# Altium schematic sheet Esquematico.SchDoc
size A4; SheetNumber: 1; SheetTotal: 1
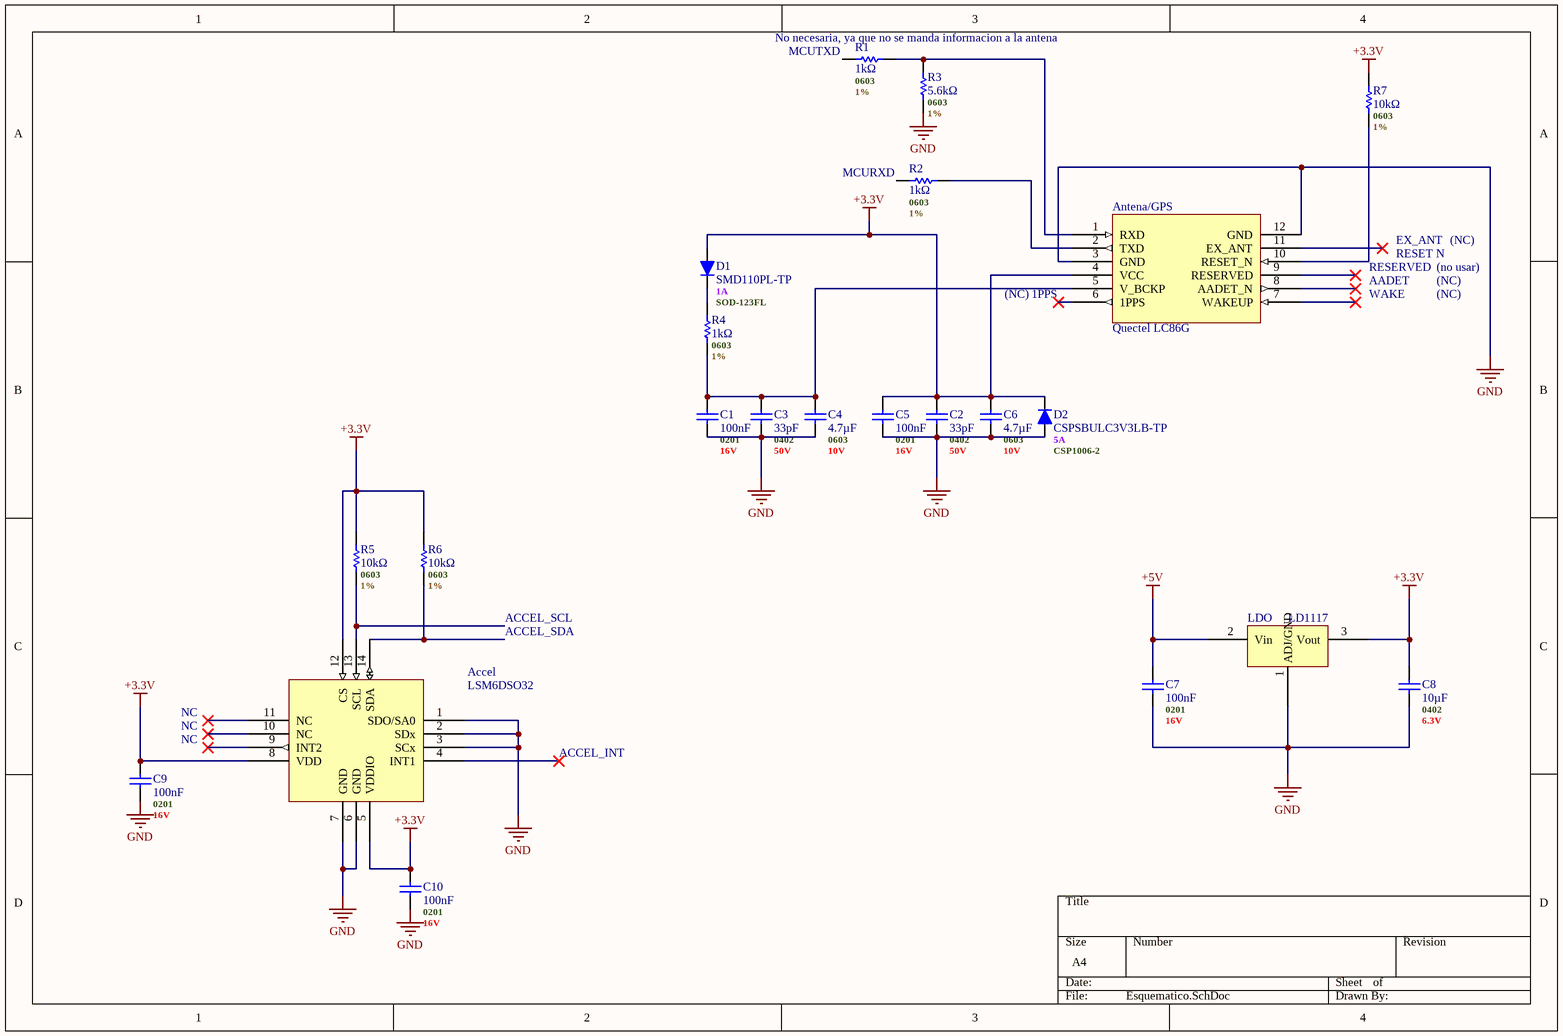
[diagram p0: Esquematico.SchDoc]

## Parts
Accel  LSM6DSO32  [14-LGA - STMicroelectronics V4]
Antena/GPS  Quectel LC86G  [Quectel-LC86L]
C1  100nF  .Case/Package: 0201  .Voltage Rating (DC): 16V  [CAPC0603X33N]
C2  33pF  .Case/Package: 0402  .Voltage Rating (DC): 50V  [CAP_CL05_SAM]
C3  33pF  .Case/Package: 0402  .Voltage Rating (DC): 50V  [CAP_CL05_SAM]
C4  4.7µF  .Case/Package: 0603  .Voltage Rating (DC): 10V  [0603-capacitor4.7uf]
C5  100nF  .Case/Package: 0201  .Voltage Rating (DC): 16V  [CAPC0603X33N]
C6  4.7µF  .Case/Package: 0603  .Voltage Rating (DC): 10V  [0603-capacitor4.7uf]
C7  100nF  .Case/Package: 0201  .Voltage Rating (DC): 16V  [CAPC0603X33N]
C8  10µF  .Case/Package: 0402  .Voltage Rating (DC): 6.3V  [CAP_CL05_SAM]
C9  100nF  .Case/Package: 0201  .Voltage Rating (DC): 16V  [CAPC0603X33N]
C10  100nF  .Case/Package: 0201  .Voltage Rating (DC): 16V  [CAPC0603X33N]
D1  SMD110PL-TP  .Current: 1A  .Case/Package: SOD-123FL  [SOD-123FL_MCC]
D2  CSPSBULC3V3LB-TP  .Current: 5A  .Case/Package: CSP1006-2  [CSPSBULC3V3LBTP]
LDO  LD1117  [DPAK-LD1117DT33TR V2]
R1  1kΩ  .Case/Package: 0603  .Tolerance: 1%  [RC0603N_YAG]
R2  1kΩ  .Case/Package: 0603  .Tolerance: 1%  [RC0603N_YAG]
R3  5.6kΩ  .Case/Package: 0603  .Tolerance: 1%  [RC0603N_YAG]
R4  1kΩ  .Case/Package: 0603  .Tolerance: 1%  [RC0603N_YAG]
R5  10kΩ  .Case/Package: 0603  .Tolerance: 1%  [RC0603N_YAG]
R6  10kΩ  .Case/Package: 0603  .Tolerance: 1%  [RC0603N_YAG]
R7  10kΩ  .Case/Package: 0603  .Tolerance: 1%  [RC0603N_YAG]

## Nets
+3.3V: Accel.5(VDDIO) Accel.8(VDD) Accel.12(CS) Antena/GPS.4(VCC) C2.1 C5.2 C6.2 C8.2 C9.2 C10.2 D1.A D2.K LDO.3(Vout) R5.2 R6.2 R7.2
+5V: C7.2 LDO.2(Vin)
GND: Accel.1(SDO/SA0) Accel.2(SDx) Accel.3(SCx) Accel.6(GND) Accel.7(GND) Antena/GPS.3(GND) Antena/GPS.12(GND) C1.1 C2.2 C3.2 C4.1 C5.1 C6.1 C7.1 C8.1 C9.1 C10.1 D2.A LDO.1(ADJ/GND) R3.1
NetAccel_13: Accel.13(SCL) R5.1
NetAccel_14: Accel.14(SDA) R6.1
NetAntena/GPS_1: Antena/GPS.1(RXD) R1.2 R3.2
NetAntena/GPS_2: Antena/GPS.2(TXD) R2.2
NetAntena/GPS_5: Antena/GPS.5(V_BCKP) C1.2 C3.1 C4.2 R4.1
NetAntena/GPS_10: Antena/GPS.10(RESET_N) R7.1
NetD1_K: D1.K R4.2

Not connected (* = marked no-connect by the designer): Accel 4(INT1)* 9(INT2)* 10(NC)* 11(NC)*; Antena/GPS 6(1PPS)* 7(WAKEUP)* 8(AADET_N)* 9(RESERVED)* 11(EX_ANT)*; R1 1; R2 1

## Notes on the sheet
- (near R1) No necesaria, ya que no se manda informacion a la antena
- (near R1) MCUTXD
- (near R2) MCURXD
- EX_ANT
- (NC)
- 1PPS
- RESERVED
- AADET
- WAKE
- RESET N
- (no usar)
- ACCEL_SCL
- ACCEL_SDA
- NC
- (near C9) NC
- ACCEL_INT

## Library data of the parts
Accel = LSM6DSO32: Accelerometer and 3D Gyroscope 3D Always-On 1.71V to 3.6V 0.55mA 14-Pin LGA T/R; Manufacturer: STMicroelectronics; Manufacturer Part Number: LSM6DSO32TR; Body Material: Plastic; Operating Supply Current: 550µA; Operating Supply Voltage: 1.8V; Output Configuration: Digital; Supplier: DigiKey; Supplier Part Number: 497-LSM6DSO32CT-ND; RoHS: Compliant; Category: Inertial Measurement Units (IMUs); Stock: 5000; Pricing: 1=3,64, 5=3,258, 10=3,115, 25=2,9448, 50=2,8282, 100=2,7213, 500=2,5064, 1000=2,45778 (USD); China RoHS: Compliant; Height: 860µm; Length: 3mm; Lifecycle Status: Production; Max Operating Temperature: 85°C; Max Supply Voltage: 3.6V; Min Operating Temperature: -40°C; Min Supply Voltage: 1.71V; Mounting Technology: Surface Mount; Number of Terminals: 14; Output Type: Digital; REACH SVHC: Yes; ComponentLink1URL: https://datasheet.octopart.com:443/LSM6DSO32TR-STMicroelectronics-datasheet-152560011.pdf?src-supplier=Upverter; ComponentLink1Description: https://datasheet.octopart.com:443/LSM6DSO32TR-STMicroelectronics-datasheet-152560011.pdf?src-supplier=Upverter; Supplier 1: DigiKey; Supplier Part Number 1: 497-LSM6DSO32CT-ND
Antena/GPS = Quectel LC86G: GNSS Module, BeiDou, Galileo, GLONASS, GPS, QZSS, 1.605375GHz, -166 dBm, 25 s, 2.55V to 3.6V; Manufacturer Part Number: LC86GLAMD; Number of Circuits: 1; Operating Supply Voltage: 3.3V; Supplier: DigiKey; Supplier Part Number: 2958-LC86GLAMDCT-ND; Manufacturer: Quectel; Category: RF Transceiver Modules and Modems; Stock: 191; Pricing: 1=10,82, 10=9,402, 25=8,908, 100=8,2298 (USD); Height - Seated (Max): 6.95mm; Length: 18.4mm; Max Operating Temperature: 85°C; Min Operating Temperature: -40°C; Number of Terminals: 36; Width: 18.4mm; ComponentLink1URL: https://datasheet.octopart.com:443/LC86GLAMD-Quectel-datasheet-165835560.pdf?src-supplier=SOS+electronic; ComponentLink1Description: https://datasheet.octopart.com:443/LC86GLAMD-Quectel-datasheet-165835560.pdf?src-supplier=SOS+electronic; Supplier 1: DigiKey; Supplier Part Number 1: 2958-LC86GLAMDCT-ND
C1 C5 C7 C9 C10 = CAP - GENERIC: 0201 0.1 uF 16 V ±10% Tolerance X7S Multilayer Ceramic Chip Capacitor; Manufacturer: Murata; Manufacturer Part Number: GRM033C71C104KE14D; Manufacturer Lifecycle Status: IN PRODUCTION; Supplier: DigiKey; Supplier Part Number: 490-10387-1-ND; RoHS: Compliant; Category: Ceramic Capacitors; Stock: 10213357; Pricing: 1=0,08, 10=0,006, 50=0,0048, 100=0,004 (USD); Value: 100nF; Case/Package: 0201; Case Code (Imperial): 0201; Case Code (Metric): 0603; Dielectric: X7S; Dielectric Material: Ceramic; Height: 300µm; Length: 600µm; Lifecycle Status: Production; Material: Ceramic; Max Operating Temperature: 125°C; Min Operating Temperature: -55°C; Mounting Technology: Surface Mount; Number of Terminals: 2; Packaging: Digi-Reel®; REACH SVHC: Yes; Schedule B: 8532240020, 8532240020|8532240020, 8532240020|8532240020|8532240020, 8532240020|8532240020|8532240020|8532240020; Termination: SMD/SMT; Thickness: 300µm; Tolerance: 10%; Voltage Rating: 16V; Voltage Rating (DC): 16V; Weight: 340.194278µg; Width: 300µm; ComponentLink1URL: https://datasheet.octopart.com:443/GRM033C71C104KE14D-Murata-datasheet-178521774.pdf?src-supplier=Arrow.cn; ComponentLink1Description: https://datasheet.octopart.com:443/GRM033C71C104KE14D-Murata-datasheet-178521774.pdf?src-supplier=Arrow.cn; ComponentLink2URL: https://datasheet.octopart.com:443/GRM033C71C104KE14D-Murata-datasheet-150009099.pdf?src-supplier=Arrow.cn; ComponentLink2Description: https://datasheet.octopart.com:443/GRM033C71C104KE14D-Murata-datasheet-150009099.pdf?src-supplier=Arrow.cn; ComponentLink3URL: https://datasheet.octopart.com:443/GRM033C71C104KE14D-Murata-datasheet-165579666.pdf?src-supplier=TME; ComponentLink3Description: https://datasheet.octopart.com:443/GRM033C71C104KE14D-Murata-datasheet-165579666.pdf?src-supplier=TME; ComponentLink4URL: https://datasheet.octopart.com:443/GRM033C71C104KE14D-Murata-datasheet-141274204.pdf?src-supplier=Ciiva; ComponentLink4Description: https://datasheet.octopart.com:443/GRM033C71C104KE14D-Murata-datasheet-141274204.pdf?src-supplier=Ciiva; ComponentLink5URL: https://datasheet.octopart.com:443/GRM033C71C104KE14D-Murata-datasheet-140675366.pdf?src-supplier=Ciiva; ComponentLink5Description: https://datasheet.octopart.com:443/GRM033C71C104KE14D-Murata-datasheet-140675366.pdf?src-supplier=Ciiva; ComponentLink6URL: https://datasheet.octopart.com:443/GRM033C71C104KE14D-Murata-datasheet-138738157.pdf?src-supplier=Ciiva; ComponentLink6Description: https://datasheet.octopart.com:443/GRM033C71C104KE14D-Murata-datasheet-138738157.pdf?src-supplier=Ciiva; ComponentLink7URL: https://datasheet.octopart.com:443/GRM033C71C104KE14D-Murata-datasheet-22122223.pdf?src-supplier=Future+Electronics; ComponentLink7Description: https://datasheet.octopart.com:443/GRM033C71C104KE14D-Murata-datasheet-22122223.pdf?src-supplier=Future+Electronics; ComponentLink8URL: https://datasheet.octopart.com/GRM033C71C104KE14D-Murata-datasheet-12515295.pdf; ComponentLink8Description: https://datasheet.octopart.com/GRM033C71C104KE14D-Murata-datasheet-12515295.pdf; ComponentLink9URL: https://datasheet.octopart.com/GRM033C71C104KE14D-Murata-datasheet-12510076.pdf; ComponentLink9Description: https://datasheet.octopart.com/GRM033C71C104KE14D-Murata-datasheet-12510076.pdf; ComponentLink10URL: https://datasheet.octopart.com/GRM033C71C104KE14D-Murata-datasheet-11978611.pdf; ComponentLink10Description: https://datasheet.octopart.com/GRM033C71C104KE14D-Murata-datasheet-11978611.pdf; ComponentLink11URL: https://datasheet.octopart.com/GRM033C71C104KE14D-Murata-datasheet-10025737.pdf; ComponentLink11Description: https://datasheet.octopart.com/GRM033C71C104KE14D-Murata-datasheet-10025737.pdf; ComponentLink12URL: https://datasheet.octopart.com/GRM033C71C104KE14D-Murata-datasheet-8819587.pdf; ComponentLink12Description: https://datasheet.octopart.com/GRM033C71C104KE14D-Murata-datasheet-8819587.pdf; ComponentLink13URL: http://sigma.octopart.com:80/reach_statement/Murata-company-16.pdf?src-supplier=Compliance+Statements; ComponentLink13Description: http://sigma.octopart.com:80/reach_statement/Murata-company-16.pdf?src-supplier=Compliance+Statements; Supplier 1: DigiKey; Supplier Part Number 1: 490-10387-1-ND
C2 C3 = CAP - GENERIC: Ceramic Capacitor, Multilayer, Ceramic, 50V, 5% +Tol, 5% -Tol, C0G, 0+-30ppm/Celcius TC, 33pF, Surface Mount, 0402 inch; Manufacturer: Samsung Electro-Mechanics; Manufacturer Part Number: CL05C330JB5NNNC; Temperature Coefficient: 30ppm/°C; Supplier: DigiKey; Supplier Part Number: 1276-1272-1-ND; RoHS: Compliant; Category: Ceramic Capacitors; Stock: 3272452; Pricing: 1=0,08, 10=0,003 (USD); Value: 33pF; Case/Package: 0402; Case Code (Imperial): 0402; Case Code (Metric): 1005; China RoHS: Compliant; Contact Plating: Tin; Depth: 500µm; Dielectric: C0G; Dielectric Material: Ceramic; Height: 550µm; Lead Free: Lead Free; Length: 1mm; Lifecycle Status: Production; Material: Ceramic; Max Operating Temperature: 125°C; Min Operating Temperature: -55°C; Mounting Technology: Surface Mount; Number of Terminals: 2; Radiation Hardening: No; REACH SVHC: Yes; Schedule B: 8532240020, 8532240020|8532240020, 8532240020|8532240020|8532240020, 8532240020|8532240020|8532240020|8532240020; Thickness: 558.8µm; Tolerance: 5%; Voltage: 50V; Voltage Rating: 50V; Voltage Rating (DC): 50V; Width: 500µm; ComponentLink1URL: https://datasheet.octopart.com:443/CL05C330JB5NNNC-Samsung-Electro-Mechanics-datasheet-136482269.pdf?src-supplier=IHS; ComponentLink1Description: https://datasheet.octopart.com:443/CL05C330JB5NNNC-Samsung-Electro-Mechanics-datasheet-136482269.pdf?src-supplier=IHS; ComponentLink2URL: https://datasheet.octopart.com:443/CL05C330JB5NNNC-Samsung-Electro-Mechanics-datasheet-141347004.pdf?src-supplier=Samsung+SCT; ComponentLink2Description: https://datasheet.octopart.com:443/CL05C330JB5NNNC-Samsung-Electro-Mechanics-datasheet-141347004.pdf?src-supplier=Samsung+SCT; ComponentLink3URL: https://datasheet.octopart.com:443/CL05C330JB5NNNC-Samsung-Electro-Mechanics-datasheet-110326805.pdf?src-supplier=Future+Electronics; ComponentLink3Description: https://datasheet.octopart.com:443/CL05C330JB5NNNC-Samsung-Electro-Mechanics-datasheet-110326805.pdf?src-supplier=Future+Electronics; ComponentLink4URL: https://datasheet.octopart.com:443/CL05C330JB5NNNC-Samsung-Electro-Mechanics-datasheet-81461748.pdf?src-supplier=Future+Electronics; ComponentLink4Description: https://datasheet.octopart.com:443/CL05C330JB5NNNC-Samsung-Electro-Mechanics-datasheet-81461748.pdf?src-supplier=Future+Electronics; ComponentLink5URL: https://datasheet.octopart.com:443/CL05C330JB5NNNC-Samsung-datasheet-12522687.pdf?src-supplier=Future+Electronics; ComponentLink5Description: https://datasheet.octopart.com:443/CL05C330JB5NNNC-Samsung-datasheet-12522687.pdf?src-supplier=Future+Electronics; ComponentLink6URL: https://datasheet.octopart.com:443/CL05C330JB5NNNC-Samsung-datasheet-26589087.pdf?src-supplier=Future+Electronics; ComponentLink6Description: https://datasheet.octopart.com:443/CL05C330JB5NNNC-Samsung-datasheet-26589087.pdf?src-supplier=Future+Electronics; ComponentLink7URL: https://datasheet.octopart.com:443/CL05C330JB5NNNC-Samsung-Electro-Mechanics-datasheet-149156440.pdf?src-supplier=Future+Electronics; ComponentLink7Description: https://datasheet.octopart.com:443/CL05C330JB5NNNC-Samsung-Electro-Mechanics-datasheet-149156440.pdf?src-supplier=Future+Electronics; ComponentLink8URL: https://datasheet.octopart.com:443/CL05C330JB5NNNC-Samsung-datasheet-37081328.pdf?src-supplier=Future+Electronics; ComponentLink8Description: https://datasheet.octopart.com:443/CL05C330JB5NNNC-Samsung-datasheet-37081328.pdf?src-supplier=Future+Electronics; ComponentLink9URL: https://datasheet.octopart.com/CL05C330JB5NNNC-Samsung-Electro-Mechanics-datasheet-97040617.pdf; ComponentLink9Description: https://datasheet.octopart.com/CL05C330JB5NNNC-Samsung-Electro-Mechanics-datasheet-97040617.pdf; ComponentLink10URL: https://datasheet.octopart.com/CL05C330JB5NNNC-Samsung-Electro-Mechanics-datasheet-8324245.pdf; ComponentLink10Description: https://datasheet.octopart.com/CL05C330JB5NNNC-Samsung-Electro-Mechanics-datasheet-8324245.pdf; ComponentLink11URL: https://datasheet.octopart.com:443/CL05C330JB5NNNC-Samsung-datasheet-8326407.pdf?src-supplier=TME; ComponentLink11Description: https://datasheet.octopart.com:443/CL05C330JB5NNNC-Samsung-datasheet-8326407.pdf?src-supplier=TME; Supplier 1: DigiKey; Supplier Part Number 1: 1276-1272-1-ND
C4 C6 = CAP - GENERIC: Ceramic Capacitor, Multilayer, Ceramic, 10V, 10% +Tol, 10% -Tol, X7R, 15% TC, 4.7uF, Surface Mount, 0603; Manufacturer: Cal-Chip Electronics; Manufacturer Part Number: GMC10X7R475K10NT; Supplier: DigiKey; Supplier Part Number: 4713-GMC10X7R475K10NTCT-ND; RoHS: Compliant; Category: Ceramic Capacitors; Stock: 237673; Pricing: 1=0,26, 10=0,154, 50=0,1112, 100=0,0982, 500=0,07628, 1000=0,06951, 4000=0,05938, 8000=0,05562, 12000=0,05374, 20000=0,05165, 28000=0,05043, 40000=0,04926, 48000=0,0487, 96000=0,04683, 100000=0,04673 (USD); Value: 4.7µF; China RoHS: Compliant; Dielectric Material: Ceramic; Height: 900µm; Length: 1.6mm; Lifecycle Status: Production; Max Operating Temperature: 125°C; Min Operating Temperature: -55°C; Mounting Technology: Surface Mount; Number of Terminals: 2; REACH SVHC: Yes; Voltage Rating (DC): 10V; Width: 800µm; ComponentLink1URL: https://datasheet.octopart.com:443/GMC10X7R475K10NT-Cal-Chip-Electronics-datasheet-182028815.pdf?src-supplier=IHS; ComponentLink1Description: https://datasheet.octopart.com:443/GMC10X7R475K10NT-Cal-Chip-Electronics-datasheet-182028815.pdf?src-supplier=IHS; Supplier 1: DigiKey; Supplier Part Number 1: 4713-GMC10X7R475K10NTCT-ND
C8 = CAP - GENERIC: 6.3V 10uF X5R ±20% 0402 Multilayer Ceramic Capacitors MLCC - SMD/SMT ROHS; Manufacturer: Samsung Electro-Mechanics; Manufacturer Part Number: CL05A106MQ5NUNC; Supplier: DigiKey; Supplier Part Number: 1276-1451-1-ND; RoHS: Compliant; Category: Ceramic Capacitors; Stock: 3652212; Pricing: 1=0,1, 10=0,054, 50=0,0464, 2500=0,044, 5000=0,0407 (USD); Value: 10µF; Case/Package: 0402; Case Code (Imperial): 0402; Case Code (Metric): 1005; China RoHS: Compliant; Depth: 500µm; Dielectric: X5R; Dielectric Material: Ceramic; Height: 700µm; Length: 1mm; Lifecycle Status: Production; Max Operating Temperature: 85°C; Min Operating Temperature: -55°C; Mounting Technology: Surface Mount; Number of Terminals: 2; Radiation Hardening: No; REACH SVHC: Yes; Schedule B: 8532240020, 8532240020|8532240020, 8532240020|8532240020|8532240020, 8532240020|8532240020|8532240020|8532240020; Thickness: 711.2µm; Tolerance: 20%; Voltage Rating: 6.3V; Voltage Rating (DC): 6.3V; Width: 500µm; ComponentLink1URL: https://datasheet.octopart.com:443/CL05A106MQ5NUNC-Samsung-Electro-Mechanics-datasheet-136031724.pdf?src-supplier=Newark; ComponentLink1Description: https://datasheet.octopart.com:443/CL05A106MQ5NUNC-Samsung-Electro-Mechanics-datasheet-136031724.pdf?src-supplier=Newark; ComponentLink2URL: https://datasheet.octopart.com:443/CL05A106MQ5NUNC-Samsung-Electro-Mechanics-datasheet-181551184.pdf?src-supplier=Newark; ComponentLink2Description: https://datasheet.octopart.com:443/CL05A106MQ5NUNC-Samsung-Electro-Mechanics-datasheet-181551184.pdf?src-supplier=Newark; ComponentLink3URL: https://datasheet.octopart.com:443/CL05A106MQ5NUNC-Samsung-Electro-Mechanics-datasheet-110226207.pdf?src-supplier=Future+Electronics; ComponentLink3Description: https://datasheet.octopart.com:443/CL05A106MQ5NUNC-Samsung-Electro-Mechanics-datasheet-110226207.pdf?src-supplier=Future+Electronics; ComponentLink4URL: https://datasheet.octopart.com:443/CL05A106MQ5NUNC-Samsung-Electro-Mechanics-datasheet-81461596.pdf?src-supplier=Future+Electronics; ComponentLink4Description: https://datasheet.octopart.com:443/CL05A106MQ5NUNC-Samsung-Electro-Mechanics-datasheet-81461596.pdf?src-supplier=Future+Electronics; ComponentLink5URL: https://datasheet.octopart.com:443/CL05A106MQ5NUNC-Samsung-datasheet-42280528.pdf?src-supplier=Future+Electronics; ComponentLink5Description: https://datasheet.octopart.com:443/CL05A106MQ5NUNC-Samsung-datasheet-42280528.pdf?src-supplier=Future+Electronics; ComponentLink6URL: https://datasheet.octopart.com:443/CL05A106MQ5NUNC-Samsung-datasheet-34153003.pdf?src-supplier=Future+Electronics; ComponentLink6Description: https://datasheet.octopart.com:443/CL05A106MQ5NUNC-Samsung-datasheet-34153003.pdf?src-supplier=Future+Electronics; ComponentLink7URL: https://datasheet.octopart.com:443/CL05A106MQ5NUNC-Samsung-datasheet-26589001.pdf?src-supplier=Future+Electronics; ComponentLink7Description: https://datasheet.octopart.com:443/CL05A106MQ5NUNC-Samsung-datasheet-26589001.pdf?src-supplier=Future+Electronics; ComponentLink8URL: https://datasheet.octopart.com:443/CL05A106MQ5NUNC-Samsung-datasheet-12538126.pdf?src-supplier=Future+Electronics; ComponentLink8Description: https://datasheet.octopart.com:443/CL05A106MQ5NUNC-Samsung-datasheet-12538126.pdf?src-supplier=Future+Electronics; ComponentLink9URL: https://datasheet.octopart.com:443/CL05A106MQ5NUNC-Samsung-Electro-Mechanics-datasheet-149136671.pdf?src-supplier=Future+Electronics; ComponentLink9Description: https://datasheet.octopart.com:443/CL05A106MQ5NUNC-Samsung-Electro-Mechanics-datasheet-149136671.pdf?src-supplier=Future+Electronics; ComponentLink10URL: https://datasheet.octopart.com:443/CL05A106MQ5NUNC-Samsung-datasheet-59220082.pdf?src-supplier=TME; ComponentLink10Description: https://datasheet.octopart.com:443/CL05A106MQ5NUNC-Samsung-datasheet-59220082.pdf?src-supplier=TME; Supplier 1: DigiKey; Supplier Part Number 1: 1276-1451-1-ND
D1 = DIODE: Rectifier Diode, Schottky, 1 Phase, 1 Element, 1A, 100V V(RRM), Silicon; Manufacturer: MCC; Element Configuration: Single; Forward Voltage: 850mV; Max Forward Surge Current (Ifsm): 30A; Number of Elements: 1; Peak Reverse Current: 10µA; Supplier: DigiKey; Supplier Part Number: SMD110PL-TPMSDKR-ND; Manufacturer Part Number: SMD110PL-TP; RoHS: Compliant; Category: Rectifier Diodes; Stock: 3407126; Pricing: 1=0,19, 10=0,118, 100=0,0796, 500=0,05812, 1000=0,05115 (USD); Average Rectified Current: 1A; China RoHS: Non-Compliant; Forward Current: 1A; Lead Free: Lead Free; Lifecycle Status: Production; Max Operating Temperature: 150°C; Max Output current: 1A; Max Repetitive Reverse Voltage (Vrrm): 100V; Max Reverse Voltage (DC): 100V; Min Operating Temperature: -55°C; Mounting Technology: Surface Mount; Pins: 2; Number of Terminals: 2; Packaging: Tape and Reel; Peak Non-Repetitive Surge Current: 30A; Radiation Hardening: No; REACH SVHC: No; Reverse Standoff Voltage: 100V; Schedule B: 8541100080, 8541100080|8541100080|8541100080|8541100080|8541100080; ComponentLink1URL: https://datasheet.octopart.com:443/SMD110PL-TP-MCC-datasheet-103922842.pdf?src-supplier=Future+Electronics; ComponentLink1Description: https://datasheet.octopart.com:443/SMD110PL-TP-MCC-datasheet-103922842.pdf?src-supplier=Future+Electronics; ComponentLink2URL: https://datasheet.octopart.com:443/SMD110PL-TP-MCC-datasheet-27907079.pdf?src-supplier=Future+Electronics; ComponentLink2Description: https://datasheet.octopart.com:443/SMD110PL-TP-MCC-datasheet-27907079.pdf?src-supplier=Future+Electronics
D2 = DIODE: Trans Voltage Suppressor Diode, 13W, 3.3V V(RWM), Bidirectional, 1 Element, Silicon; Manufacturer: MCC; Breakdown Voltage: 6.5V; Clamping Voltage: 2.9V; Max Breakdown Voltage: 8V; Min Breakdown Voltage: 4.5V; Number of Elements: 1; Peak Reverse Current: 100nA; Supplier: DigiKey; Supplier Part Number: 353-CSPSBULC3V3LB-TPCT-ND; Manufacturer Part Number: CSPSBULC3V3LB-TP; RoHS: Compliant; Category: TVS Diodes; Stock: 8320; Pricing: 1=0,23, 10=0,152, 100=0,076, 500=0,06174, 1000=0,044, 2000=0,041, 5000=0,036 (USD); Lifecycle Status: Production; Max Operating Temperature: 125°C; Min Operating Temperature: -55°C; Number of Terminals: 2; Peak Pulse Power: 13W; Polarity: Bidirectional; REACH SVHC: Yes; Reverse Standoff Voltage: 3.3V
LDO = LD1117: Output ail-to- ail Very-Low-Noise Operational Amplifier 14-SOIC -40 to 125; Manufacturer: STMicroelectronics; Manufacturer Part Number: LD1117DT33TR; Accuracy: 1%; Dropout Voltage: 1.1V; Input Bias Current: 5mA; Max Supply Voltage: 15V; Max Junction Temperature (Tj): 125°C; Max Output current: 1.3A; Max Power Dissipation: 12W; Min Input Voltage: 4.75V; Nominal Output Voltage: 3.3V; Number of Channels: 1; Output Current: 800mA; Output Type: Fixed; Polarity: Positive; Voltage Tolerance: 2%; Supplier: DigiKey; Supplier Part Number: 497-1236-1-ND; RoHS: Compliant; Category: LDO Voltage Regulators; Stock: 24539; Pricing: 1=0,48, 10=0,339, 25=0,3028, 100=0,2629, 250=0,24392, 500=0,23244, 1000=0,22299 (USD); Case/Package: TO-252; China RoHS: Non-Compliant; Contact Plating: Tin; Height: 2.4mm; Height - Seated (Max): 2.3mm; Length: 6.5mm; Lifecycle Status: Production; Max Operating Temperature: 125°C; Min Operating Temperature: 0°C; Mounting Technology: Surface Mount; Nominal Supply Current: 5mA; Number of Circuits: 1; Number of Outputs: 1; Pins: 3; Number of Regulators: 1; Number of Terminals: 2; Output Voltage: 3.3V; Output Voltage Accuracy: 1%; Packaging: Tape and Reel; Power Dissipation: 12W; Power Rating: 12W; Quiescent Current: 5mA; Radiation Hardening: No; REACH SVHC: No; Schedule B: 8542390000, 8542390000|8542390000|8542390000|8542390000|8542390000; Terminal Pitch: 2.28mm; Tolerance: 1%; Weight: 4.535924g; Width: 6.1mm; ComponentLink1URL: https://datasheet.octopart.com:443/LD1117DT33TR-STMicroelectronics-datasheet-21631343.pdf?src-supplier=element14+APAC; ComponentLink1Description: https://datasheet.octopart.com:443/LD1117DT33TR-STMicroelectronics-datasheet-21631343.pdf?src-supplier=element14+APAC; ComponentLink2URL: https://datasheet.octopart.com:443/LD1117DT33TR-STMicroelectronics-datasheet-12512609.pdf?src-supplier=Upverter; ComponentLink2Description: https://datasheet.octopart.com:443/LD1117DT33TR-STMicroelectronics-datasheet-12512609.pdf?src-supplier=Upverter; ComponentLink3URL: https://datasheet.octopart.com:443/LD1117DT33TR-STMicroelectronics-datasheet-10835789.pdf?src-supplier=Upverter; ComponentLink3Description: https://datasheet.octopart.com:443/LD1117DT33TR-STMicroelectronics-datasheet-10835789.pdf?src-supplier=Upverter; ComponentLink4URL: https://datasheet.octopart.com:443/LD1117DT33TR-STMicroelectronics-datasheet-10544930.pdf?src-supplier=Upverter; ComponentLink4Description: https://datasheet.octopart.com:443/LD1117DT33TR-STMicroelectronics-datasheet-10544930.pdf?src-supplier=Upverter; ComponentLink5URL: https://datasheet.octopart.com:443/LD1117DT33TR-STMicroelectronics-datasheet-10390305.pdf?src-supplier=Upverter; ComponentLink5Description: https://datasheet.octopart.com:443/LD1117DT33TR-STMicroelectronics-datasheet-10390305.pdf?src-supplier=Upverter; ComponentLink6URL: https://datasheet.octopart.com:443/LD1117DT33TR-STMicroelectronics-datasheet-8082140.pdf?src-supplier=element14; ComponentLink6Description: https://datasheet.octopart.com:443/LD1117DT33TR-STMicroelectronics-datasheet-8082140.pdf?src-supplier=element14; ComponentLink7URL: https://datasheet.octopart.com:443/LD1117DT33TR-STMicroelectronics-datasheet-8710537.pdf?src-supplier=element14; ComponentLink7Description: https://datasheet.octopart.com:443/LD1117DT33TR-STMicroelectronics-datasheet-8710537.pdf?src-supplier=element14; ComponentLink8URL: https://datasheet.octopart.com:443/LD1117DT33TR-STMicroelectronics-datasheet-8453752.pdf?src-supplier=element14; ComponentLink8Description: https://datasheet.octopart.com:443/LD1117DT33TR-STMicroelectronics-datasheet-8453752.pdf?src-supplier=element14; ComponentLink9URL: https://datasheet.octopart.com:443/LD1117DT33TR-STMicroelectronics-datasheet-9746.pdf?src-supplier=DigiKey; ComponentLink9Description: https://datasheet.octopart.com:443/LD1117DT33TR-STMicroelectronics-datasheet-9746.pdf?src-supplier=DigiKey; ComponentLink10URL: https://datasheet.octopart.com:443/LD1117DT33TR-STMicroelectronics-datasheet-14168930.pdf?src-supplier=iiiC; ComponentLink10Description: https://datasheet.octopart.com:443/LD1117DT33TR-STMicroelectronics-datasheet-14168930.pdf?src-supplier=iiiC; ComponentLink11URL: https://datasheet.octopart.com:443/LD1117DT33TR-STMicroelectronics-datasheet-5314031.pdf?src-supplier=Nu+Horizons; ComponentLink11Description: https://datasheet.octopart.com:443/LD1117DT33TR-STMicroelectronics-datasheet-5314031.pdf?src-supplier=Nu+Horizons; ComponentLink12URL: https://datasheet.octopart.com:443/LD1117DT33TR-STMicroelectronics-datasheet-502396.pdf?src-supplier=Nu+Horizons; ComponentLink12Description: https://datasheet.octopart.com:443/LD1117DT33TR-STMicroelectronics-datasheet-502396.pdf?src-supplier=Nu+Horizons; ComponentLink13URL: https://datasheet.octopart.com:443/LD1117DT33TR-STMicroelectronics-datasheet-109521.pdf?src-supplier=Nu+Horizons; ComponentLink13Description: https://datasheet.octopart.com:443/LD1117DT33TR-STMicroelectronics-datasheet-109521.pdf?src-supplier=Nu+Horizons; ComponentLink14URL: https://datasheet.octopart.com:443/LD1117DT33TR-STMicroelectronics-datasheet-7556021.pdf?src-supplier=Jameco; ComponentLink14Description: https://datasheet.octopart.com:443/LD1117DT33TR-STMicroelectronics-datasheet-7556021.pdf?src-supplier=Jameco; ComponentLink15URL: https://datasheet.octopart.com:443/LD1117DT33TR-STMicroelectronics-datasheet-113917.pdf?src-supplier=Sierra+IC; ComponentLink15Description: https://datasheet.octopart.com:443/LD1117DT33TR-STMicroelectronics-datasheet-113917.pdf?src-supplier=Sierra+IC; Supplier 1: DigiKey; Supplier Part Number 1: 497-1236-1-ND
R1 R2 R4 = RESISTOR - GENERIC: Fixed Resistor, Thin Film, 0.1W, 1000ohm, 75V, 1% +/-Tol, 50ppm/Cel, Surface Mount, 0603; Manufacturer: Yageo Group; Manufacturer Part Number: RT0603FRE071KL; Max Power Dissipation: 100mW; Temperature Coefficient: 50ppm/°C; Supplier: DigiKey; Supplier Part Number: YAG2323CT-ND; RoHS: Compliant; Category: Chip SMD Resistors; Stock: 146447; Pricing: 1=0,1, 10=0,014, 25=0,0112, 50=0,0082, 100=0,0081, 250=0,00764 (USD); Case/Package: 0603; Case Code (Imperial): 0603; China RoHS: Non-Compliant; Composition: Thin Film; Contact Plating: Lead, Tin; Depth: 800µm; Features: Moisture Resistant; Height: 450µm; Lead Free: Lead Free; Length: 1.6mm; Lifecycle Status: Production; Max Operating Temperature: 155°C; Military Standard: Not; Min Operating Temperature: -55°C; Mounting Technology: Surface Mount; Pins: 2; Number of Terminals: 2; Number of Terminations: 2; Packaging: Tape & Reel; Power Dissipation: 100mW; Power Rating: 100mW; REACH SVHC: Yes; Value: 1kΩ; Schedule B: 8533210045, 8533210045|8533210045|8533210045|8533210045|8533210045|8533210045|8533210045|8533210045|8533210045|8533210045|8533210045|8533210045|8533210045|8533210045|8533210045|8533210045|8533210045|8533210045|8533210045|8533210045|8533210045|8533210045|8533210045|85; Termination: SMD/SMT; Tolerance: 1%; Voltage Rating: 75V; Voltage Rating (DC): 75V; Width: 800µm; Working Voltage: 75V; ComponentLink1URL: https://datasheet.octopart.com:443/RT0603FRE071KL-Yageo-datasheet-176402239.pdf?src-supplier=IHS; ComponentLink1Description: https://datasheet.octopart.com:443/RT0603FRE071KL-Yageo-datasheet-176402239.pdf?src-supplier=IHS; ComponentLink2URL: https://datasheet.octopart.com:443/RT0603FRE071KL-Yageo-datasheet-10915759.pdf?src-supplier=element14+APAC; ComponentLink2Description: https://datasheet.octopart.com:443/RT0603FRE071KL-Yageo-datasheet-10915759.pdf?src-supplier=element14+APAC; ComponentLink3URL: https://datasheet.octopart.com:443/RT0603FRE071KL-Yageo-datasheet-67645616.pdf?src-supplier=element14+APAC; ComponentLink3Description: https://datasheet.octopart.com:443/RT0603FRE071KL-Yageo-datasheet-67645616.pdf?src-supplier=element14+APAC; ComponentLink4URL: https://datasheet.octopart.com:443/RT0603FRE071KL-Yageo-datasheet-8324589.pdf?src-supplier=Newark; ComponentLink4Description: https://datasheet.octopart.com:443/RT0603FRE071KL-Yageo-datasheet-8324589.pdf?src-supplier=Newark; ComponentLink5URL: https://datasheet.octopart.com:443/RT0603FRE071KL-Yageo-datasheet-164439670.pdf?src-supplier=Newark; ComponentLink5Description: https://datasheet.octopart.com:443/RT0603FRE071KL-Yageo-datasheet-164439670.pdf?src-supplier=Newark; ComponentLink6URL: https://datasheet.octopart.com:443/RT0603FRE071KL-Yageo-datasheet-169971040.pdf?src-supplier=Future+Electronics; ComponentLink6Description: https://datasheet.octopart.com:443/RT0603FRE071KL-Yageo-datasheet-169971040.pdf?src-supplier=Future+Electronics; ComponentLink7URL: https://datasheet.octopart.com:443/RT0603FRE071KL-Yageo-datasheet-166250672.pdf?src-supplier=Future+Electronics; ComponentLink7Description: https://datasheet.octopart.com:443/RT0603FRE071KL-Yageo-datasheet-166250672.pdf?src-supplier=Future+Electronics; ComponentLink8URL: https://datasheet.octopart.com:443/RT0603FRE071KL-Yageo-datasheet-136673517.pdf?src-supplier=Future+Electronics; ComponentLink8Description: https://datasheet.octopart.com:443/RT0603FRE071KL-Yageo-datasheet-136673517.pdf?src-supplier=Future+Electronics; ComponentLink9URL: https://datasheet.octopart.com:443/RT0603FRE071KL-Yageo-datasheet-137700930.pdf?src-supplier=Future+Electronics; ComponentLink9Description: https://datasheet.octopart.com:443/RT0603FRE071KL-Yageo-datasheet-137700930.pdf?src-supplier=Future+Electronics; ComponentLink10URL: https://datasheet.octopart.com:443/RT0603FRE071KL-Yageo-datasheet-96443642.pdf?src-supplier=Future+Electronics; ComponentLink10Description: https://datasheet.octopart.com:443/RT0603FRE071KL-Yageo-datasheet-96443642.pdf?src-supplier=Future+Electronics; ComponentLink11URL: https://datasheet.octopart.com:443/RT0603FRE071KL-Yageo-datasheet-68361100.pdf?src-supplier=Future+Electronics; ComponentLink11Description: https://datasheet.octopart.com:443/RT0603FRE071KL-Yageo-datasheet-68361100.pdf?src-supplier=Future+Electronics; ComponentLink12URL: https://datasheet.octopart.com:443/RT0603FRE071KL-Yageo-datasheet-41589729.pdf?src-supplier=Future+Electronics; ComponentLink12Description: https://datasheet.octopart.com:443/RT0603FRE071KL-Yageo-datasheet-41589729.pdf?src-supplier=Future+Electronics; ComponentLink13URL: https://datasheet.octopart.com:443/RT0603FRE071KL-Yageo-datasheet-12594463.pdf?src-supplier=Future+Electronics; ComponentLink13Description: https://datasheet.octopart.com:443/RT0603FRE071KL-Yageo-datasheet-12594463.pdf?src-supplier=Future+Electronics; ComponentLink14URL: https://datasheet.octopart.com:443/RT0603FRE071KL-Yageo-datasheet-34924148.pdf?src-supplier=Future+Electronics; ComponentLink14Description: https://datasheet.octopart.com:443/RT0603FRE071KL-Yageo-datasheet-34924148.pdf?src-supplier=Future+Electronics; ComponentLink15URL: https://datasheet.octopart.com:443/RT0603FRE071KL-Yageo-Group-datasheet-141265893.pdf?src-supplier=ODG+(Origin+Data+Global); ComponentLink15Description: https://datasheet.octopart.com:443/RT0603FRE071KL-Yageo-Group-datasheet-141265893.pdf?src-supplier=ODG+(Origin+Data+Global); ComponentLink16URL: https://datasheet.octopart.com:443/RT0603FRE071KL-Yageo-datasheet-83209228.pdf?src-supplier=SOS+electronic; ComponentLink16Description: https://datasheet.octopart.com:443/RT0603FRE071KL-Yageo-datasheet-83209228.pdf?src-supplier=SOS+electronic; ComponentLink17URL: https://datasheet.octopart.com/RT0603FRE071KL-Yageo-datasheet-86813807.pdf; ComponentLink17Description: https://datasheet.octopart.com/RT0603FRE071KL-Yageo-datasheet-86813807.pdf; ComponentLink18URL: http://sigma.octopart.com:80/rohs_statement/Yageo-company-2.pdf?src-supplier=Compliance+Statements; ComponentLink18Description: http://sigma.octopart.com:80/rohs_statement/Yageo-company-2.pdf?src-supplier=Compliance+Statements; ComponentLink19URL: http://sigma.octopart.com:80/conflict_mineral_statement/Yageo-company-3.pdf?src-supplier=Compliance+Statements; ComponentLink19Description: http://sigma.octopart.com:80/conflict_mineral_statement/Yageo-company-3.pdf?src-supplier=Compliance+Statements; Supplier 1: DigiKey; Supplier Part Number 1: YAG2323CT-ND
R3 = RESISTOR - GENERIC: Res Thick Film 0603 5.6K Ohm 1% 0.1W(1/10W) ±100ppm/C Pad SMD T/R; Manufacturer: Yageo Group; Manufacturer Part Number: RC0603FR-075K6L; Max Power Dissipation: 100mW; Temperature Coefficient: 100ppm/°C; Voltage Rating: 50V; Working Voltage: 75V; Supplier: DigiKey; Supplier Part Number: 311-5.60KHRCT-ND; RoHS: Compliant; Category: Chip SMD Resistors; Stock: 87676; Pricing: 1=0,1, 10=0,009, 25=0,0088, 50=0,0082, 100=0,0051 (USD); Case/Package: 0603; Case Code (Imperial): 0603; Case Code (Metric): 1608; China RoHS: Non-Compliant; Composition: Thick Film; Depth: 800µm; Features: Moisture Resistant; Height: 450µm; Lead Free: Lead Free; Length: 1.6mm; Lifecycle Status: Production; Max Operating Temperature: 155°C; Military Standard: Not; Min Operating Temperature: -55°C; Mounting Technology: Surface Mount; Pins: 2; Number of Terminals: 2; Number of Terminations: 2; Packaging: Tape and Reel; Power Dissipation: 100mW; Power Rating: 100mW; REACH SVHC: Yes; Value: 5.6kΩ; Schedule B: 8533210045, 8533210045|8533210045, 8533210045|8533210045|8533210045, 8533210045|8533210045|8533210045|8533210045; Termination: SMD/SMT; Tolerance: 1%; Voltage Rating (AC): 50V; Voltage Rating (DC): 50V; Weight: 2.012816mg; Width: 800µm; ComponentLink1URL: https://datasheet.octopart.com:443/RC0603FR-075K6L-Yageo-datasheet-175887523.pdf?src-supplier=IHS; ComponentLink1Description: https://datasheet.octopart.com:443/RC0603FR-075K6L-Yageo-datasheet-175887523.pdf?src-supplier=IHS; ComponentLink2URL: https://datasheet.octopart.com:443/RC0603FR-075K6L-Yageo-datasheet-62067350.pdf?src-supplier=Newark; ComponentLink2Description: https://datasheet.octopart.com:443/RC0603FR-075K6L-Yageo-datasheet-62067350.pdf?src-supplier=Newark; ComponentLink3URL: https://datasheet.octopart.com:443/RC0603FR-075K6L-Yageo-datasheet-8328172.pdf?src-supplier=Newark; ComponentLink3Description: https://datasheet.octopart.com:443/RC0603FR-075K6L-Yageo-datasheet-8328172.pdf?src-supplier=Newark; ComponentLink4URL: https://datasheet.octopart.com:443/RC0603FR-075K6L-Yageo-datasheet-34211833.pdf?src-supplier=Newark; ComponentLink4Description: https://datasheet.octopart.com:443/RC0603FR-075K6L-Yageo-datasheet-34211833.pdf?src-supplier=Newark; ComponentLink5URL: https://datasheet.octopart.com:443/RC0603FR-075K6L-Yageo-datasheet-503470.pdf?src-supplier=Newark; ComponentLink5Description: https://datasheet.octopart.com:443/RC0603FR-075K6L-Yageo-datasheet-503470.pdf?src-supplier=Newark; ComponentLink6URL: https://datasheet.octopart.com:443/RC0603FR-075K6L-Yageo-Group-datasheet-176638170.pdf?src-supplier=Newark; ComponentLink6Description: https://datasheet.octopart.com:443/RC0603FR-075K6L-Yageo-Group-datasheet-176638170.pdf?src-supplier=Newark; ComponentLink7URL: https://datasheet.octopart.com:443/RC0603FR-075K6L-Yageo-datasheet-103092701.pdf?src-supplier=Upverter; ComponentLink7Description: https://datasheet.octopart.com:443/RC0603FR-075K6L-Yageo-datasheet-103092701.pdf?src-supplier=Upverter; ComponentLink8URL: https://datasheet.octopart.com:443/RC0603FR-075K6L-Yageo-datasheet-98239111.pdf?src-supplier=Upverter; ComponentLink8Description: https://datasheet.octopart.com:443/RC0603FR-075K6L-Yageo-datasheet-98239111.pdf?src-supplier=Upverter; ComponentLink9URL: https://datasheet.octopart.com:443/RC0603FR-075K6L-Yageo-datasheet-164759695.pdf?src-supplier=Future+Electronics; ComponentLink9Description: https://datasheet.octopart.com:443/RC0603FR-075K6L-Yageo-datasheet-164759695.pdf?src-supplier=Future+Electronics; ComponentLink10URL: https://datasheet.octopart.com:443/RC0603FR-075K6L-Yageo-datasheet-137700087.pdf?src-supplier=Future+Electronics; ComponentLink10Description: https://datasheet.octopart.com:443/RC0603FR-075K6L-Yageo-datasheet-137700087.pdf?src-supplier=Future+Electronics; ComponentLink11URL: https://datasheet.octopart.com:443/RC0603FR075K6L-Yageo-datasheet-27584510.pdf?src-supplier=Future+Electronics; ComponentLink11Description: https://datasheet.octopart.com:443/RC0603FR075K6L-Yageo-datasheet-27584510.pdf?src-supplier=Future+Electronics; ComponentLink12URL: https://datasheet.octopart.com:443/RC0603FR-075K6L-Yageo-datasheet-15599030.pdf?src-supplier=Future+Electronics; ComponentLink12Description: https://datasheet.octopart.com:443/RC0603FR-075K6L-Yageo-datasheet-15599030.pdf?src-supplier=Future+Electronics; ComponentLink13URL: https://datasheet.octopart.com:443/RC0603FR-075K6L-Yageo-datasheet-12596169.pdf?src-supplier=Future+Electronics; ComponentLink13Description: https://datasheet.octopart.com:443/RC0603FR-075K6L-Yageo-datasheet-12596169.pdf?src-supplier=Future+Electronics; ComponentLink14URL: https://datasheet.octopart.com:443/RC0603FR-075K6L-Yageo-datasheet-148775077.pdf?src-supplier=TME; ComponentLink14Description: https://datasheet.octopart.com:443/RC0603FR-075K6L-Yageo-datasheet-148775077.pdf?src-supplier=TME; ComponentLink15URL: https://datasheet.octopart.com/RC0603FR-075K6L-Yageo-datasheet-73766026.pdf; ComponentLink15Description: https://datasheet.octopart.com/RC0603FR-075K6L-Yageo-datasheet-73766026.pdf; ComponentLink16URL: https://datasheet.octopart.com:443/RC0603FR-075K6L-Yageo-datasheet-118562.pdf?src-supplier=DigiKey; ComponentLink16Description: https://datasheet.octopart.com:443/RC0603FR-075K6L-Yageo-datasheet-118562.pdf?src-supplier=DigiKey; ComponentLink17URL: http://sigma.octopart.com:80/rohs_statement/Yageo-company-2.pdf?src-supplier=Compliance+Statements; ComponentLink17Description: http://sigma.octopart.com:80/rohs_statement/Yageo-company-2.pdf?src-supplier=Compliance+Statements; ComponentLink18URL: http://sigma.octopart.com:80/conflict_mineral_statement/Yageo-company-3.pdf?src-supplier=Compliance+Statements; ComponentLink18Description: http://sigma.octopart.com:80/conflict_mineral_statement/Yageo-company-3.pdf?src-supplier=Compliance+Statements; Supplier 1: DigiKey; Supplier Part Number 1: 311-5.60KHRCT-ND
R5-R7 = RESISTOR - GENERIC: 100mW Thick Film Resistors 75V ±100ppm/℃ ±1% 10kΩ 0603 Chip Resistor - Surface Mount ROHS; Manufacturer: Yageo Group; Manufacturer Part Number: RC0603FR-0710KL; Temperature Coefficient: 100ppm/°C; Voltage Rating (DC): 50V; Supplier: DigiKey; Supplier Part Number: 311-10.0KHRCT-ND; RoHS: Compliant; Category: Chip SMD Resistors; Stock: 13522970; Pricing: 1=0,1, 10=0,006, 25=0,0052 (USD); Case/Package: 0603; Case Code (Imperial): 0603; Case Code (Metric): 0603; China RoHS: Non-Compliant; Composition: Thick Film; Depth: 800µm; Height: 450µm; Lead Free: Lead Free; Lead Pitch: 300µm; Length: 1.6mm; Lifecycle Status: Production; Max Operating Temperature: 155°C; Military Standard: Not; Min Operating Temperature: -55°C; Mounting Technology: Surface Mount; Pins: 2; Number of Terminals: 2; Packaging: Tape & Reel; Power Dissipation: 100mW; Power Rating: 100mW; REACH SVHC: Yes; Value: 10kΩ; Schedule B: 8533210045, 8533210045|8533210045|8533210045|8533210045|8533210045|8533210045|8533210045|8533210045|8533210045|8533210045|8533210045|8533210045|8533210045|8533210045|8533210045|8533210045|8533210045|8533210045|8533210045|8533210045|8533210045|8533210045|8533210045|85; Termination: SMD/SMT; Tolerance: 1%; Voltage Rating: 75V; Weight: 2.012816mg; Width: 800µm; Working Voltage: 75V; ComponentLink1URL: https://datasheet.octopart.com:443/RC0603FR-0710KL-Yageo-datasheet-175887523.pdf?src-supplier=IHS; ComponentLink1Description: https://datasheet.octopart.com:443/RC0603FR-0710KL-Yageo-datasheet-175887523.pdf?src-supplier=IHS; ComponentLink2URL: https://datasheet.octopart.com:443/RC0603FR-0710KL-Yageo-datasheet-103092701.pdf?src-supplier=Upverter; ComponentLink2Description: https://datasheet.octopart.com:443/RC0603FR-0710KL-Yageo-datasheet-103092701.pdf?src-supplier=Upverter; ComponentLink3URL: https://datasheet.octopart.com:443/RC0603FR-0710KL-Yageo-datasheet-98239111.pdf?src-supplier=Upverter; ComponentLink3Description: https://datasheet.octopart.com:443/RC0603FR-0710KL-Yageo-datasheet-98239111.pdf?src-supplier=Upverter; ComponentLink4URL: https://datasheet.octopart.com:443/RC0603FR-0710KL-Yageo-datasheet-141265859.pdf?src-supplier=Upverter; ComponentLink4Description: https://datasheet.octopart.com:443/RC0603FR-0710KL-Yageo-datasheet-141265859.pdf?src-supplier=Upverter; ComponentLink5URL: https://sigma.octopart.com:443/138820526/technical_drawing/Yageo-RC0603FR-0710KL.pdf?src-supplier=Upverter; ComponentLink5Description: https://sigma.octopart.com:443/138820526/technical_drawing/Yageo-RC0603FR-0710KL.pdf?src-supplier=Upverter; ComponentLink6URL: https://datasheet.octopart.com:443/RC0603FR-0710KL-Yageo-datasheet-8328172.pdf?src-supplier=Farnell; ComponentLink6Description: https://datasheet.octopart.com:443/RC0603FR-0710KL-Yageo-datasheet-8328172.pdf?src-supplier=Farnell; ComponentLink7URL: https://datasheet.octopart.com:443/RC0603FR-0710KL-Yageo-datasheet-13691069.pdf?src-supplier=Farnell; ComponentLink7Description: https://datasheet.octopart.com:443/RC0603FR-0710KL-Yageo-datasheet-13691069.pdf?src-supplier=Farnell; ComponentLink8URL: https://datasheet.octopart.com:443/RC0603FR-0710KL-Yageo-datasheet-62067350.pdf?src-supplier=element14+APAC; ComponentLink8Description: https://datasheet.octopart.com:443/RC0603FR-0710KL-Yageo-datasheet-62067350.pdf?src-supplier=element14+APAC; ComponentLink9URL: https://datasheet.octopart.com:443/RC0603FR-0710KL-Yageo-datasheet-17842380.pdf?src-supplier=element14+APAC; ComponentLink9Description: https://datasheet.octopart.com:443/RC0603FR-0710KL-Yageo-datasheet-17842380.pdf?src-supplier=element14+APAC; ComponentLink10URL: https://datasheet.octopart.com:443/RC0603FR-0710KL-Yageo-datasheet-15599030.pdf?src-supplier=Future+Electronics; ComponentLink10Description: https://datasheet.octopart.com:443/RC0603FR-0710KL-Yageo-datasheet-15599030.pdf?src-supplier=Future+Electronics; ComponentLink11URL: https://datasheet.octopart.com:443/RC0603FR-0710KL-Yageo-datasheet-164759695.pdf?src-supplier=Future+Electronics; ComponentLink11Description: https://datasheet.octopart.com:443/RC0603FR-0710KL-Yageo-datasheet-164759695.pdf?src-supplier=Future+Electronics; ComponentLink12URL: https://datasheet.octopart.com:443/RC0603FR-0710KL-Yageo-datasheet-127823281.pdf?src-supplier=Future+Electronics; ComponentLink12Description: https://datasheet.octopart.com:443/RC0603FR-0710KL-Yageo-datasheet-127823281.pdf?src-supplier=Future+Electronics; ComponentLink13URL: https://datasheet.octopart.com:443/RC0603FR-0710KL-Yageo-datasheet-137700087.pdf?src-supplier=Future+Electronics; ComponentLink13Description: https://datasheet.octopart.com:443/RC0603FR-0710KL-Yageo-datasheet-137700087.pdf?src-supplier=Future+Electronics; ComponentLink14URL: https://datasheet.octopart.com:443/RC0603FR-0710KL-Yageo-datasheet-27584510.pdf?src-supplier=Future+Electronics; ComponentLink14Description: https://datasheet.octopart.com:443/RC0603FR-0710KL-Yageo-datasheet-27584510.pdf?src-supplier=Future+Electronics; ComponentLink15URL: https://datasheet.octopart.com:443/RC0603FR-0710KL-Yageo-datasheet-8324193.pdf?src-supplier=Future+Electronics; ComponentLink15Description: https://datasheet.octopart.com:443/RC0603FR-0710KL-Yageo-datasheet-8324193.pdf?src-supplier=Future+Electronics; ComponentLink16URL: https://datasheet.octopart.com:443/RC0603FR-0710KL-Yageo-datasheet-12596169.pdf?src-supplier=Newark; ComponentLink16Description: https://datasheet.octopart.com:443/RC0603FR-0710KL-Yageo-datasheet-12596169.pdf?src-supplier=Newark; ComponentLink17URL: https://datasheet.octopart.com:443/RC0603FR-0710KL-Yageo-datasheet-503470.pdf?src-supplier=Newark; ComponentLink17Description: https://datasheet.octopart.com:443/RC0603FR-0710KL-Yageo-datasheet-503470.pdf?src-supplier=Newark; ComponentLink18URL: https://datasheet.octopart.com:443/RC0603FR-0710KL-Yageo-datasheet-34211833.pdf?src-supplier=Newark; ComponentLink18Description: https://datasheet.octopart.com:443/RC0603FR-0710KL-Yageo-datasheet-34211833.pdf?src-supplier=Newark; ComponentLink19URL: https://datasheet.octopart.com:443/RC0603FR-0710KL-Yageo-datasheet-79472498.pdf?src-supplier=Megastar; ComponentLink19Description: https://datasheet.octopart.com:443/RC0603FR-0710KL-Yageo-datasheet-79472498.pdf?src-supplier=Megastar; ComponentLink20URL: https://datasheet.octopart.com/RC0603FR-0710KL-Yageo-datasheet-73766026.pdf; ComponentLink20Description: https://datasheet.octopart.com/RC0603FR-0710KL-Yageo-datasheet-73766026.pdf; ComponentLink21URL: https://datasheet.octopart.com:443/RC0603FR-0710KL-Yageo-datasheet-118562.pdf?src-supplier=DigiKey; ComponentLink21Description: https://datasheet.octopart.com:443/RC0603FR-0710KL-Yageo-datasheet-118562.pdf?src-supplier=DigiKey; ComponentLink22URL: http://sigma.octopart.com:80/conflict_mineral_statement/Yageo-company-3.pdf?src-supplier=Compliance+Statements; ComponentLink22Description: http://sigma.octopart.com:80/conflict_mineral_statement/Yageo-company-3.pdf?src-supplier=Compliance+Statements; ComponentLink23URL: http://sigma.octopart.com:80/rohs_statement/Yageo-company-2.pdf?src-supplier=Compliance+Statements; ComponentLink23Description: http://sigma.octopart.com:80/rohs_statement/Yageo-company-2.pdf?src-supplier=Compliance+Statements; Supplier 1: DigiKey; Supplier Part Number 1: 311-10.0KHRCT-ND